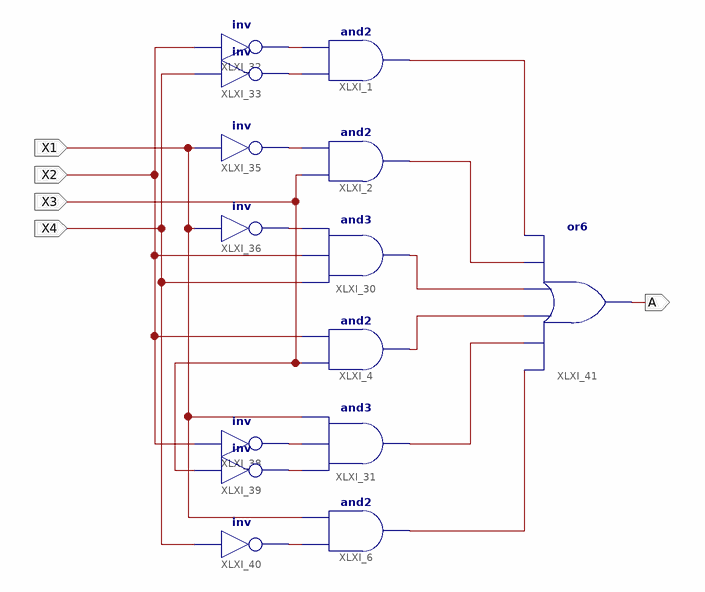
[diagram p0: schematic sheet 1]
// Xilinx ISE schematic bin7seg_a.sch (spartan3e) as structural Verilog: 14 symbols, 5 ports
module bin7seg_a (
  input  X1,
  input  X2,
  input  X3,
  input  X4,
  output A
);

  wire XLXN_1, XLXN_2, XLXN_4, XLXN_5, XLXN_6, XLXN_7, XLXN_8, XLXN_9, XLXN_10, XLXN_13, XLXN_16, XLXN_44,
       XLXN_45;

  and XLXI_1 (XLXN_9, XLXN_2, XLXN_1);
  and XLXI_4 (XLXN_16, X3, X2);
  and XLXI_6 (XLXN_45, XLXN_8, X1);
  and XLXI_2 (XLXN_10, X3, XLXN_4);
  and XLXI_30 (XLXN_13, X4, X2, XLXN_5);
  and XLXI_31 (XLXN_44, XLXN_7, XLXN_6, X1);
  not XLXI_32 (XLXN_1, X2);
  not XLXI_33 (XLXN_2, X4);
  not XLXI_35 (XLXN_4, X1);
  not XLXI_36 (XLXN_5, X1);
  not XLXI_38 (XLXN_6, X2);
  not XLXI_39 (XLXN_7, X3);
  or XLXI_41 (A, XLXN_45, XLXN_44, XLXN_16, XLXN_13, XLXN_10, XLXN_9);
  not XLXI_40 (XLXN_8, X4);
endmodule
